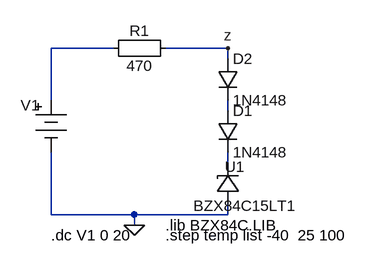
[diagram p0: schematic zener_va_15v_compensated.asc]
zener_va_15v_compensated.asc, the LTspice schematic file:
Version 4
SHEET 1 880 680
WIRE 112 -352 16 -352
WIRE 288 -352 192 -352
WIRE 288 -336 288 -352
WIRE 16 -272 16 -352
WIRE 288 -256 288 -272
WIRE 288 -176 288 -192
WIRE 16 -96 16 -192
WIRE 144 -96 16 -96
WIRE 288 -96 288 -112
WIRE 288 -96 144 -96
WIRE 144 -80 144 -96
FLAG 144 -80 0
FLAG 288 -352 z
SYMBOL Misc\\battery 16 -288 R0
WINDOW 123 0 0 Left 2
WINDOW 39 0 0 Left 2
WINDOW 0 -47 24 Left 2
WINDOW 3 -45 72 Left 2
SYMATTR InstName V1
SYMATTR Value ""
SYMBOL Misc\\EuropeanResistor 208 -368 R90
WINDOW 0 5 56 VBottom 2
WINDOW 3 27 56 VTop 2
SYMATTR InstName R1
SYMATTR Value 470
SYMBOL zener-macro-model 304 -112 R180
WINDOW 0 -10 58 Left 2
WINDOW 3 -91 -2 Left 2
SYMATTR InstName U1
SYMATTR Value BZX84C15LT1
SYMBOL diode 272 -256 R0
SYMATTR InstName D1
SYMATTR Value 1N4148
SYMBOL diode 272 -336 R0
SYMATTR InstName D2
SYMATTR Value 1N4148
TEXT 16 -64 Left 2 !.dc V1 0 20
TEXT 192 -64 Left 2 !.step temp list -40  25 100
TEXT 192 -80 Left 2 !.lib BZX84C.LIB

The netlist it stands for:
* zener_va_15v_compensated.asc
V1 N001 0
R1 z N001 470
XU1 0 N003 BZX84C15LT1  ; pins + -
D1 N002 N003 1N4148
D2 z N002 1N4148
.model D D
.lib standard.dio
.dc V1 0 20
.step temp list -40  25 100
.lib BZX84C.LIB
.backanno
.end